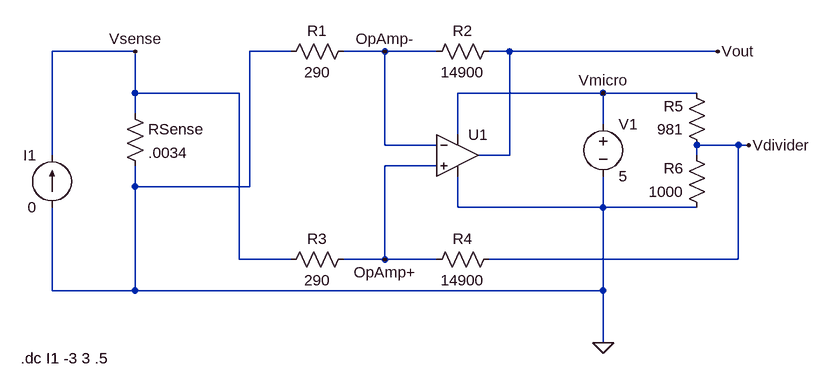
[diagram p0: schematic Current sensing circuit.asc]
Current sensing circuit.asc, the LTspice schematic file:
Version 4
SHEET 1 880 680
WIRE -336 16 -464 16
WIRE -96 16 -160 16
WIRE 48 16 -16 16
WIRE 128 16 48 16
WIRE 240 16 208 16
WIRE 560 16 240 16
WIRE -336 80 -336 16
WIRE -176 80 -336 80
WIRE 384 80 160 80
WIRE 528 80 384 80
WIRE -336 112 -336 80
WIRE 384 128 384 80
WIRE 160 144 160 80
WIRE 48 160 48 16
WIRE 128 160 48 160
WIRE 592 160 528 160
WIRE 608 160 592 160
WIRE -464 176 -464 16
WIRE 240 176 240 16
WIRE 240 176 192 176
WIRE 528 176 528 160
WIRE 128 192 48 192
WIRE -336 224 -336 192
WIRE -160 224 -160 16
WIRE -160 224 -336 224
WIRE 160 256 160 208
WIRE 384 256 384 208
WIRE 384 256 160 256
WIRE 528 256 384 256
WIRE -176 336 -176 80
WIRE -96 336 -176 336
WIRE 48 336 48 192
WIRE 48 336 -16 336
WIRE 128 336 48 336
WIRE 592 336 592 160
WIRE 592 336 208 336
WIRE -464 384 -464 256
WIRE -336 384 -336 224
WIRE -336 384 -464 384
WIRE 384 384 384 256
WIRE 384 384 -336 384
WIRE 384 464 384 384
FLAG 560 16 Vout
FLAG -336 16 Vsense
FLAG 384 80 Vmicro
FLAG 608 160 Vdivider
FLAG 48 16 OpAmp-
FLAG 48 336 OpAmp+
FLAG 384 464 0
SYMBOL voltage 384 112 R0
WINDOW 123 0 0 Left 0
WINDOW 39 0 0 Left 0
SYMATTR InstName V1
SYMATTR Value 5
SYMBOL res 0 0 R90
WINDOW 0 0 56 VBottom 2
WINDOW 3 32 56 VTop 2
SYMATTR InstName R1
SYMATTR Value 290
SYMBOL res 224 0 R90
WINDOW 0 0 56 VBottom 2
WINDOW 3 32 56 VTop 2
SYMATTR InstName R2
SYMATTR Value 14900
SYMBOL res 0 320 R90
WINDOW 0 0 56 VBottom 2
WINDOW 3 32 56 VTop 2
SYMATTR InstName R3
SYMATTR Value 290
SYMBOL res 224 320 R90
WINDOW 0 0 56 VBottom 2
WINDOW 3 32 56 VTop 2
SYMATTR InstName R4
SYMATTR Value 14900
SYMBOL res 544 176 R180
WINDOW 0 36 76 Left 2
WINDOW 3 36 40 Left 2
SYMATTR InstName R5
SYMATTR Value 981
SYMBOL res 544 272 R180
WINDOW 0 36 76 Left 2
WINDOW 3 36 40 Left 2
SYMATTR InstName R6
SYMATTR Value 1000
SYMBOL res -352 96 R0
SYMATTR InstName RSense
SYMATTR Value .0034
SYMBOL Opamps\\UniversalOpamp2 160 176 R0
SYMATTR InstName U1
SYMBOL current -464 256 R180
WINDOW 0 24 80 Left 2
WINDOW 3 24 0 Left 2
SYMATTR InstName I1
SYMATTR Value 0
TEXT -512 488 Left 2 !.dc I1 -3 3 .5

The netlist it stands for:
* Current sensing circuit.asc
V1 Vmicro 0 5
R1 OpAmp- 0 290
R2 Vout OpAmp- 14900
R3 OpAmp+ Vsense 290
R4 Vdivider OpAmp+ 14900
R5 Vdivider Vmicro 981
R6 0 Vdivider 1000
RSense Vsense 0 .0034
XU1 OpAmp+ OpAmp- Vmicro 0 Vout level.2 Avol=1Meg GBW=10Meg Slew=10Meg ilimit=25m rail=0 Vos=0 phimargin=45 en=0 enk=0 in=0 ink=0 Rin=500Meg  ; pins IN+ IN- V+ V- OUT
I1 0 Vsense 0
.dc I1 -3 3 .5
.lib UniversalOpamps2.sub
.backanno
.end

* Results of the author's LTspice run, read from the files saved beside the schematic
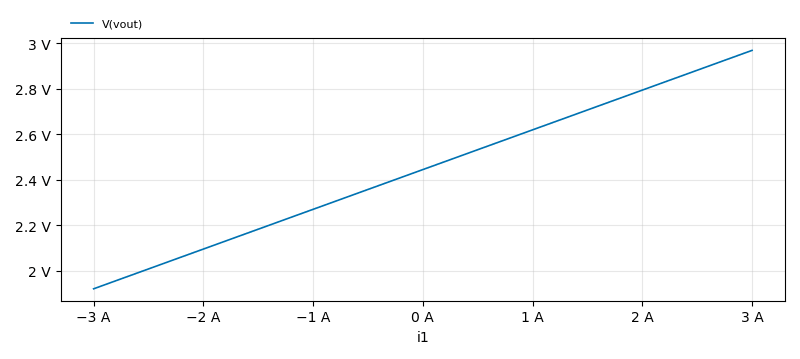
[diagram p1: DC transfer characteristic of Current sensing circuit.asc, plotted from the saved traces]
* DC transfer characteristic, 1 run:
*   V(vout): 1.92 V at i1=-3 A, 2.969 V at i1=3 A, min 1.92 V, max 2.969 V